# EAGLE schematic timer (EAGLE 6.4)
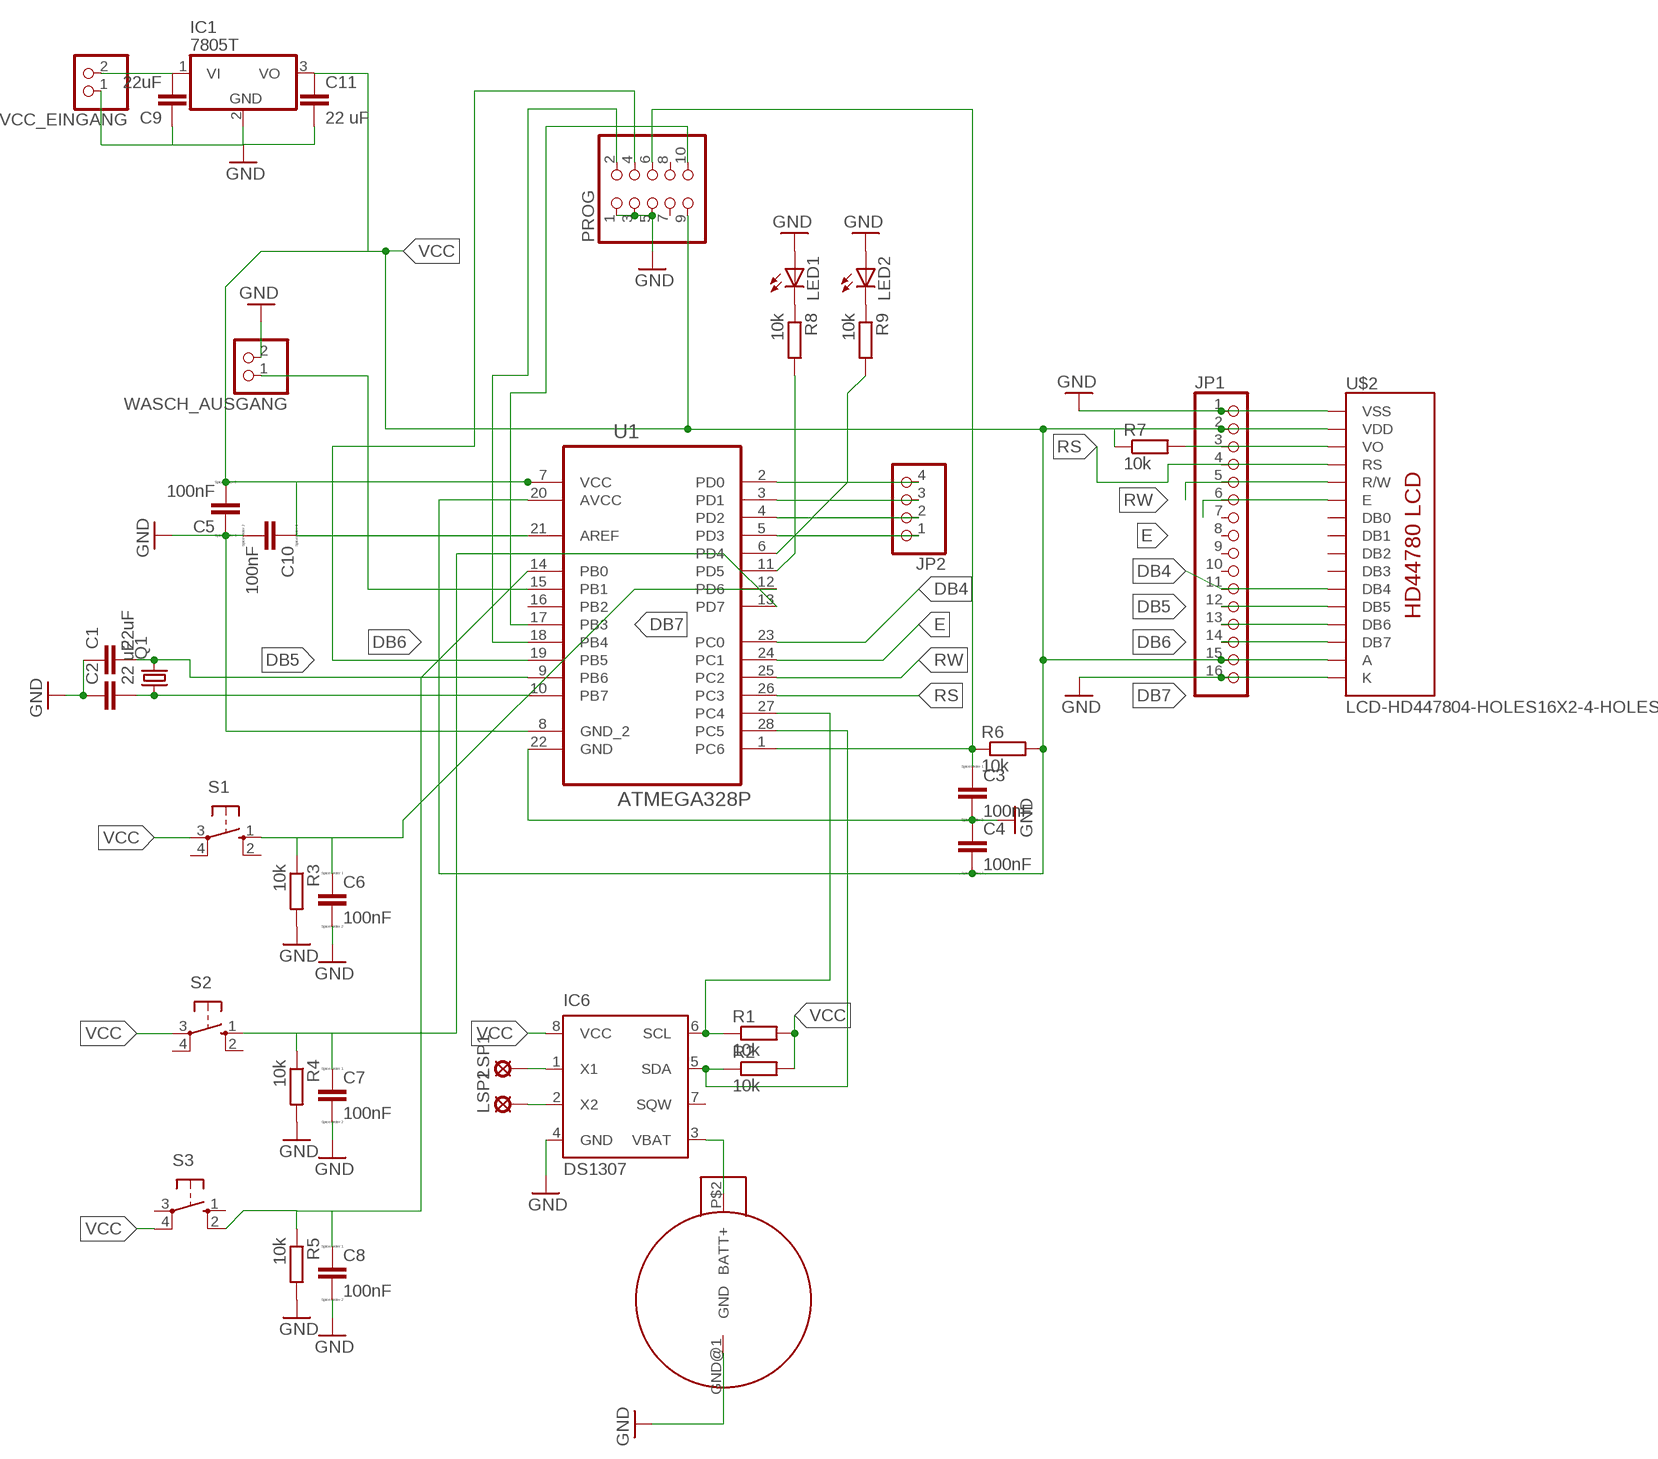
[diagram p0: schematic, sheet 1]

## Parts
C1  22uF  C-EU025-025X050  [C025-025X050]
C2  22 uF  C-EU025-025X050  [C025-025X050]
C3  100nF  CC0603  [C0603]
C4  100nF  CC0603  [C0603]
C5  100nF  CC0603  [C0603]
C6  100nF  CC0603  [C0603]
C7  100nF  CC0603  [C0603]
C8  100nF  CC0603  [C0603]
C9  22uF  C-EU025-025X050  [C025-025X050]
C10  100nF  CC0603  [C0603]
C11  22 uF  C-EU025-025X050  [C025-025X050]
IC1  7805T  [TO220H]
IC6  DS1307  [DIL08]
JP1  PINHD-1X16  [1X16]
JP2  PINHD-1X4/90  [1X04/90]
LED1  LED5MM  [LED5MM]
LED2  LED5MM  [LED5MM]
LSP1  LSP10  [LSP10]
LSP2  LSP10  [LSP10]
PROG  PINHD-2X5  [2X05]
Q1  CRYSTALHC49U-V  [HC49U-V]
R1  10k  R-EU_0204/7  [0204/7]
R2  10k  R-EU_0204/7  [0204/7]
R3  10k  R-EU_0204/7  [0204/7]
R4  10k  R-EU_0204/7  [0204/7]
R5  10k  R-EU_0204/7  [0204/7]
R6  10k  R-EU_0204/7  [0204/7]
R7  10k  R-EU_0204/7  [0204/7]
R8  10k  R-EU_0204/7  [0204/7]
R9  10k  R-EU_0204/7  [0204/7]
S1  10-XX  [B3F-10XX]
S2  10-XX  [B3F-10XX]
S3  10-XX  [B3F-10XX]
U1  ATMEGA328P  ATMEGA328P-PU  [DIP254P762X457-28]
U$1  CR2032  [CR2023]
U$2  LCD-HD447804-HOLES16X2-4-HOLES  [LCD-16X2-4HOLES]
VCC_EINGANG  PINHD-1X2  [1X02]
WASCH_AUSGANG  PINHD-1X2  [1X02]

## Nets
DB4: JP1.11 U1.23(PC0) U$2.11(DB4)
DB5: JP1.12 PROG.4 U1.19(PB5) U$2.12(DB5)
DB6: JP1.13 PROG.2 U1.18(PB4) U$2.13(DB6)
DB7: JP1.14 PROG.10 U1.17(PB3) U$2.14(DB7)
E: JP1.6 U1.24(PC1) U$2.6(E)
GND: C1.1 C2.1 C3.2 C4.1 C5.1 C6.2 C7.2 C8.2 C9.1 C10.2 C11.2 IC1.2(GND) IC6.4(GND) JP1.1 JP1.16 LED1.A LED2.A PROG.1 PROG.3 PROG.5 R3.2 R4.2 R5.2 U1.8(GND_2) U1.22(GND) U$1.GND@1(GND) U$2.1(VSS) U$2.16(K) VCC_EINGANG.1 WASCH_AUSGANG.2
N$1: LED1.K(C) R8.1
N$2: JP1.3 R7.2 U$2.3(VO)
N$3: U1.15(PB1) WASCH_AUSGANG.1
N$4: LED2.K(C) R9.1
N$5: C3.1 PROG.6 R6.1 U1.1(PC6)
N$6: JP2.4 U1.2(PD0)
N$7: C9.2 IC1.1(VI) VCC_EINGANG.2
N$8: C7.1 R4.1 S2.1(S) U1.13(PD7)
N$9: JP2.3 U1.3(PD1)
N$10: JP2.2 U1.4(PD2)
N$11: C8.1 R5.1 S3.2(S1) U1.14(PB0)
N$12: JP2.1 U1.5(PD3)
N$13: R8.2 U1.11(PD5)
N$14: R9.2 U1.6(PD4)
N$20: C6.1 R3.1 S1.1(S) U1.12(PD6)
N$33: IC6.2(X2) LSP2.MP
N$37: IC6.1(X1) LSP1.MP
N$38: IC6.3(VBAT) U$1.P$2(BATT+)
N$39: IC6.6(SCL) R1.1 U1.27(PC4)
N$40: IC6.5(SDA) R2.1 U1.28(PC5)
N$44: C1.2 Q1.2 U1.9(PB6)
N$46: C2.2 Q1.1 U1.10(PB7)
RS: JP1.4 U1.26(PC3) U$2.4(RS)
RW: JP1.5 U1.25(PC2) U$2.5(R/W)
VCC: C4.2 C5.2 C10.1 C11.1 IC1.3(VO) IC6.8(VCC) JP1.2 JP1.15 PROG.9 R1.2 R2.2 R6.2 R7.1 S1.3(P) S2.3(P) S3.4(P1) U1.7(VCC) U1.20(AVCC) U1.21(AREF) U$2.2(VDD) U$2.15(A)
Unconnected: IC6.7(SQW) JP1.7 JP1.8 JP1.9 JP1.10 PROG.7 PROG.8 S1.2(S1) S1.4(P1) S2.2(S1) S2.4(P1) S3.1(S) S3.3(P) U1.16(PB2) U$2.7(DB0) U$2.8(DB1) U$2.9(DB2) U$2.10(DB3)

## Library data of the parts
C1 C2 C9 C11 = resistor:C-EU: CAPACITOR, European symbol
C3-C8 C10 = eagle-ltspice:C: CAPACITOR, European symbol; SPICEMODEL: NONE; SPICEPREFIX: C
IC1 = linear:78*: Positive VOLTAGE REGULATOR Source: http://cache.national.com/ds/LM/LM78L05.pdf http://www.fairchildsemi.com/ds/LM/LM7805.pdf
IC6 = ds1307_pcf8583:DS1307: I2C-Bus CLOCK/CALENDAR
JP1 = pinhead:PINHD-1X16: PIN HEADER
JP2 = pinhead:PINHD-1X4: PIN HEADER
LED1 LED2 = led:LED: LED OSRAM: - CHIPLED LG R971, LG N971, LY N971, LG Q971, LY Q971, LO R971, LY R971 LH N974, LH R974 LS Q976, LO Q976, LY Q976 LO Q996 - Hyper CHIPLED LW Q18S LB Q993, LB Q99A, LB R99A - SideLED LS A670, LO A670, LY A670, LG A670, LP A670 LB A673, LV A673, LT A673, LW A673 LH A674 LY A675 LS A676, LA A676, LO A676, LY A676, LW A676 LS A679, LY A679, LG A679 - Hyper Micro SIDELED® LS Y876, LA Y876, LO Y876, LY Y876 LT Y87S - SmartLED LW L88C, LW L88S LB L89C, LB L89S, LG L890 LS L89K, LO L89K, LY L89K LS L896, LA L896, LO L896, LY L896 - TOPLED LS T670, LO T670, LY T670, LG T670, LP T670 LSG T670, LSP T670, LSY T670, LOP T670, LYG T670 LG T671, LOG T671, LSG T671 LB T673, LV T673, LT T673, LW T673 LH T674 LS T676, LA T676, LO T676, LY T676, LB T676, LH T676, LSB T676, LW T676 LB T67C, LV T67C, LT T67C, LS T67K, LO T67K, LY T67K, LW E67C LS E67B, LA E67B, LO E67B, LY E67B, LB E67C, LV E67C, LT E67C LW T67C LS T679, LY T679, LG T679 LS T770, LO T770, LY T770, LG T770, LP T770 LB T773, LV T773, LT T773, LW T773 LH T774 LS E675, LA E675, LY E675, LS T675 LS T776, LA T776, LO T776, LY T776, LB T776 LHGB T686 LT T68C, LB T68C - Hyper Mini TOPLED® LB M676 - Mini TOPLED Santana® LG M470 LS M47K, LO M47K, LY M47K Source: http://www.osram.convergy.de LUXEON: - LUMILED® LXK2-PW12-R00, LXK2-PW12-S00, LXK2-PW14-U00, LXK2-PW14-V00 LXK2-PM12-R00, LXK2-PM12-S00, LXK2-PM14-U00 LXK2-PE12-Q00, LXK2-PE12-R00, LXK2-PE12-S00, LXK2-PE14-T00, LXK2-PE14-U00 LXK2-PB12-K00, LXK2-PB12-L00, LXK2-PB12-M00, LXK2-PB14-N00, LXK2-PB14-P00, LXK2-PB14-Q00 LXK2-PR12-L00, LXK2-PR12-M00, LXK2-PR14-Q00, LXK2-PR14-R00 LXK2-PD12-Q00, LXK2-PD12-R00, LXK2-PD12-S00 LXK2-PH12-R00, LXK2-PH12-S00 LXK2-PL12-P00, LXK2-PL12-Q00, LXK2-PL12-R00 Source: www.luxeon.com KINGBRIGHT: KA-3528ASYC Source: www.kingbright.com
LSP1 LSP2 = solpad:LSP10: SOLDER PAD drill 1.0 mm, distributor Buerklin, 12H555
PROG = pinhead:PINHD-2X5: PIN HEADER
Q1 = crystal:CRYSTAL: CRYSTAL; OC_FARNELL: 1666969; OC_NEWARK: unknown
R1-R9 = resistor:R-EU_: RESISTOR, European symbol
S1-S3 = switch-omron:10-XX: OMRON SWITCH; MPN: B3F-1000; OC_FARNELL: 176432; OC_NEWARK: 36M3542
U1 = Atmel_By_element14_Batch_1:ATMEGA328P-PU: 8-bit Microcontroller with In-System Programmable Flash; MPN: ATMEGA328P-PU; OC_FARNELL: 1715487; OC_NEWARK: 15R0268; PACKAGE: PDIP-28; SUPPLIER: Atmel
U$1 = 2032:CR2032
U$2 = HD44780LCD:LCD-HD44780
VCC_EINGANG WASCH_AUSGANG = pinhead:PINHD-1X2: PIN HEADER

## Net classes
0 default: width 0.381 mm, drill 0.508 mm, clearance 0.254 mm